# Altium project FMC-320U-B1.PrjPcb
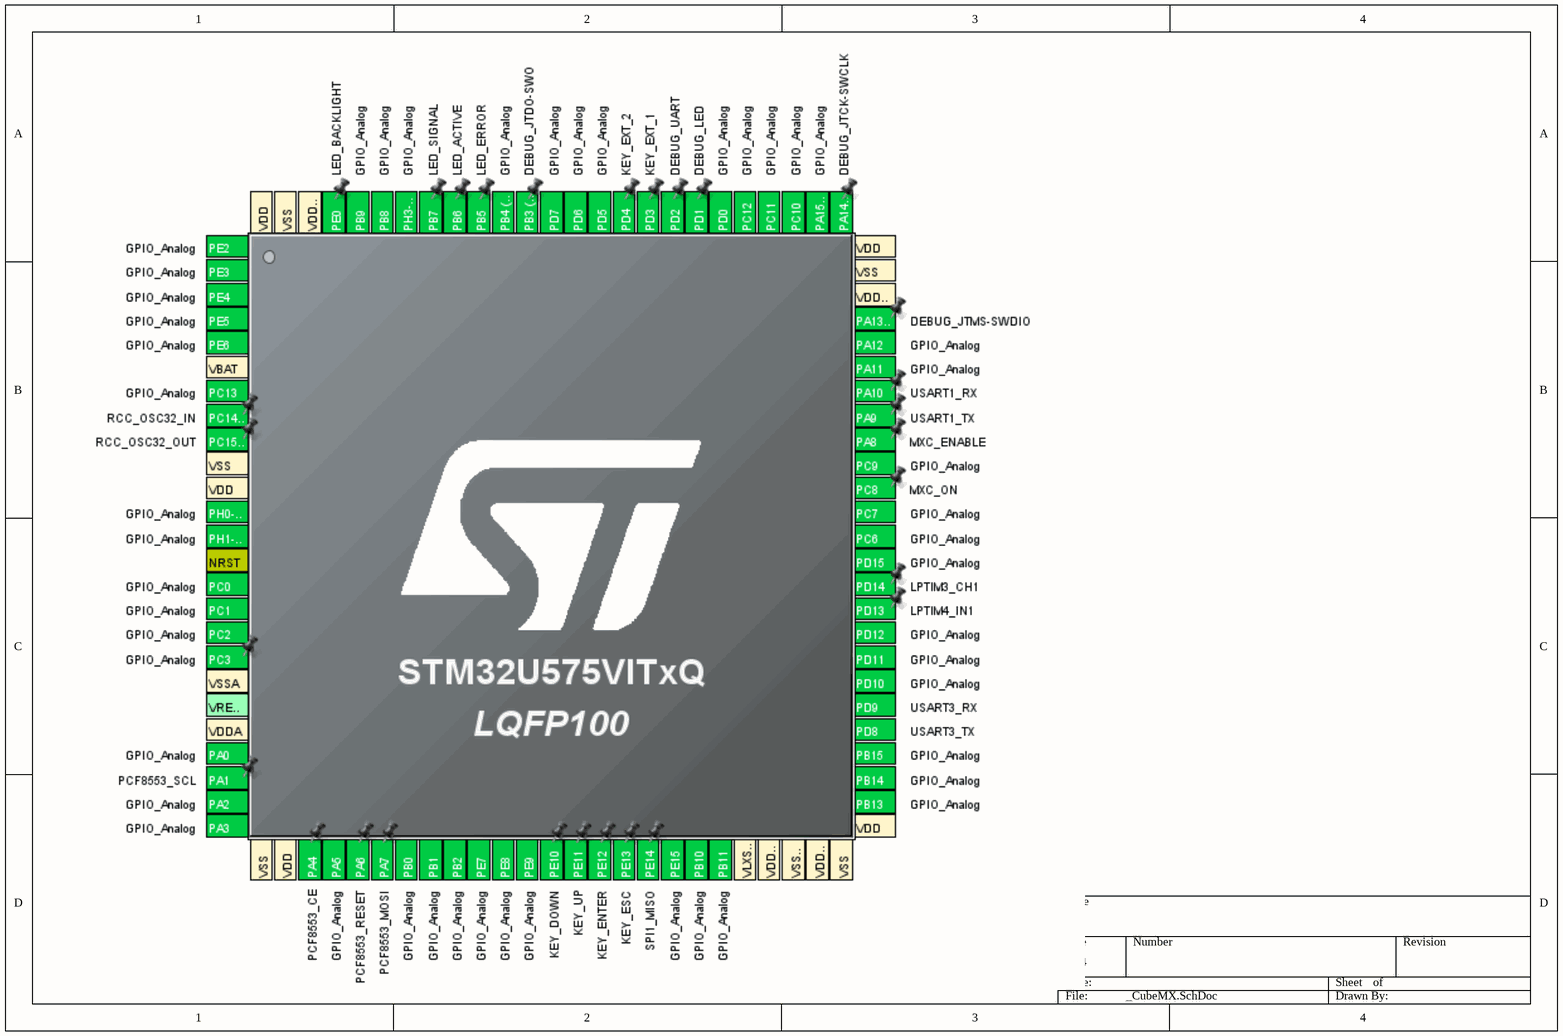
[diagram p0: _CubeMX.SchDoc]
7 sheets, 83 parts. Net scope: flat (ports and power ports of the same name join across sheets).
Board file: FMC-320U-B1.PcbDoc
Sheets:
  _CubeMX.SchDoc
  Display_Indicators.SchDoc
  Interboard.SchDoc
  Keypad_Temp_BatLevel.SchDoc
  MCU_Debug.SchDoc
  MCU_GPIO.SchDoc
  MCU_Power_Clock.SchDoc

## Sheet _CubeMX.SchDoc
size A4; SheetNumber: 7; SheetTotal: 7

## Sheet Display_Indicators.SchDoc
size A4; Organization: Altium Limited; Address1: L3, 12a Rodborough Rd; Address2: Frenchs Forest; Address3: NSW; Address4: Australia 2086; SheetNumber: 2; SheetTotal: 7
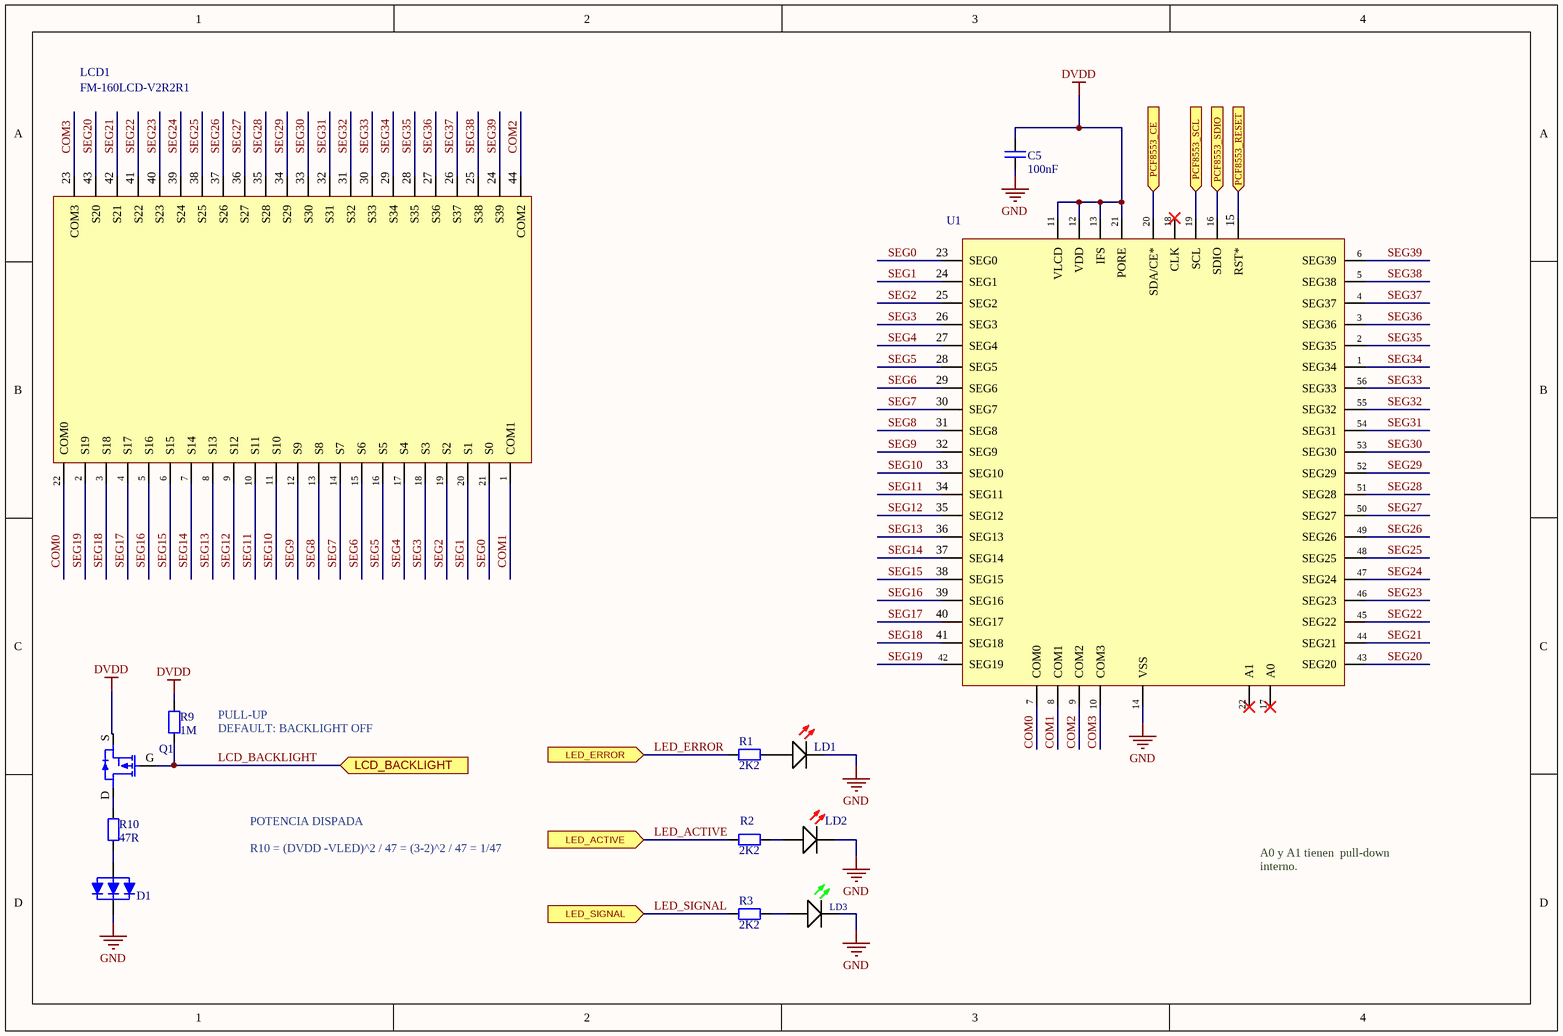
[diagram p1: Display_Indicators.SchDoc]

### Parts
C5  100nF  [CAP_SM0603_YAGEOCC2_N]
D1  BACKLIGHT  [BACKLIGHT_2]  (value not drawn)  (no BOM)
LCD1  FM-160LCD-V2R2R1  [FMC-160LCD V2]
LD1  RED  [LED 0805]  (value not drawn)
LD2  RED  [LED 0805]  (value not drawn)
LD3  GREEN  [LED 0805]  (value not drawn)
Q1  DMG3401LSN-7  [DMG3401LSN-7]  (value not drawn)
R1  2K2  [RES_SM0603_YAGEORC_N]
R2  2K2  [RES_SM0603_YAGEORC_N]
R3  2K2  [RES_SM0603_YAGEORC_N]
R9  1M  [RES_SM0603_YAGEORC_N]
R10  47R  [RES_SM0603_YAGEORC_N]
U1  (no value)  [LCD DRIVER - TSSOP56]

### Ports
LCD_BACKLIGHT (in), LED_ACTIVE (in), LED_ERROR (in), LED_SIGNAL (in), PCF8553_CE (in), PCF8553_RESET (in), PCF8553_SCL (in), PCF8553_SDIO (in)

### Nets
DVDD: C5.1 Q1.S R9.2 U1.11(VLCD) U1.12(VDD) U1.13(IFS) U1.21(PORE)
GND: C5.2 D1.2 LD1.K LD2.K LD3.K U1.14(VSS)
COM0: LCD1.22(COM0) U1.7(COM0)
COM1: LCD1.1(COM1) U1.8(COM1)
COM2: LCD1.44(COM2) U1.9(COM2)
COM3: LCD1.23(COM3) U1.10(COM3)
LCD_BACKLIGHT: Q1.G R9.1 ; port LCD_BACKLIGHT
LED_ACTIVE: R2.1 ; port LED_ACTIVE
LED_ERROR: R1.1 ; port LED_ERROR
LED_SIGNAL: R3.1 ; port LED_SIGNAL
SEG0: LCD1.21(S0) U1.23(SEG0)
SEG1: LCD1.20(S1) U1.24(SEG1)
SEG2: LCD1.19(S2) U1.25(SEG2)
SEG3: LCD1.18(S3) U1.26(SEG3)
SEG4: LCD1.17(S4) U1.27(SEG4)
SEG5: LCD1.16(S5) U1.28(SEG5)
SEG6: LCD1.15(S6) U1.29(SEG6)
SEG7: LCD1.14(S7) U1.30(SEG7)
SEG8: LCD1.13(S8) U1.31(SEG8)
SEG9: LCD1.12(S9) U1.32(SEG9)
SEG10: LCD1.11(S10) U1.33(SEG10)
SEG11: LCD1.10(S11) U1.34(SEG11)
SEG12: LCD1.9(S12) U1.35(SEG12)
SEG13: LCD1.8(S13) U1.36(SEG13)
SEG14: LCD1.7(S14) U1.37(SEG14)
SEG15: LCD1.6(S15) U1.38(SEG15)
SEG16: LCD1.5(S16) U1.39(SEG16)
SEG17: LCD1.4(S17) U1.40(SEG17)
SEG18: LCD1.3(S18) U1.41(SEG18)
SEG19: LCD1.2(S19) U1.42(SEG19)
SEG20: LCD1.43(S20) U1.43(SEG20)
SEG21: LCD1.42(S21) U1.44(SEG21)
SEG22: LCD1.41(S22) U1.45(SEG22)
SEG23: LCD1.40(S23) U1.46(SEG23)
SEG24: LCD1.39(S24) U1.47(SEG24)
SEG25: LCD1.38(S25) U1.48(SEG25)
SEG26: LCD1.37(S26) U1.49(SEG26)
SEG27: LCD1.36(S27) U1.50(SEG27)
SEG28: LCD1.35(S28) U1.51(SEG28)
SEG29: LCD1.34(S29) U1.52(SEG29)
SEG30: LCD1.33(S30) U1.53(SEG30)
SEG31: LCD1.32(S31) U1.54(SEG31)
SEG32: LCD1.31(S32) U1.55(SEG32)
SEG33: LCD1.30(S33) U1.56(SEG33)
SEG34: LCD1.29(S34) U1.1(SEG34)
SEG35: LCD1.28(S35) U1.2(SEG35)
SEG36: LCD1.27(S36) U1.3(SEG36)
SEG37: LCD1.26(S37) U1.4(SEG37)
SEG38: LCD1.25(S38) U1.5(SEG38)
SEG39: LCD1.24(S39) U1.6(SEG39)
NetD1_1: D1.1 R10.1
NetLD1_A: LD1.A R1.2
NetLD2_A: LD2.A R2.2
NetLD3_A: LD3.A R3.2
NetQ1_D: Q1.D R10.2
NetU1_15: U1.15(RST*) ; port PCF8553_RESET
NetU1_16: U1.16(SDIO) ; port PCF8553_SDIO
NetU1_19: U1.19(SCL) ; port PCF8553_SCL
NetU1_20: U1.20(SDA/CE*) ; port PCF8553_CE

Not connected (* = marked no-connect by the designer): U1 17(A0)* 18(CLK)* 22(A1)*

### Notes on the sheet
- (near R9) PULL-UP
  DEFAULT: BACKLIGHT OFF
- POTENCIA DISPADA
  R10 = (DVDD -VLED)^2 / 47 = (3-2)^2 / 47 = 1/47
- A0 y A1 tienen  pull-down interno.
- Title:
- Size: A4
- Date:
- FMC-320U MODEL A
- Sheet:
- Time:
- Of:
- Version:
- Revision:
- Release:
- 1
- 0
- FLOWMEET SRL
- File

### Library data of the parts
C5 = CC0603KRX7R9BB104: CAP 100nF SM0603 X7R 50V YAGEO CC2; Tolerance (%): 10; Voltage Rating (Volts): 50; Category: Capacitor; Manufacturer: Yageo; Manufacturer Part Number: CC0603KRX7R9BB104; Package: 0603; Value: 100nF; Supplier Part Number 1: 1362556; Supplier 1: Farnell; ComponentLink1URL: http://www.yageo.com; ComponentLink1Description: Manufacturer Website; Supplier 2: Digi-Key; Supplier Part Number 2: 311-1344-1-ND; Datasheet: https://datasheet.lcsc.com/lcsc/2211101700_YAGEO-CC0603KRX7R9BB104_C14663.pdf
D1 = FM-160-BACKLIGHT: IF=45mA;VF=3V; Manufacturer: FLOWMEET; Manufacturer Part Number: FM-160-BACKLIGHT; Category: Backlight; Datasheet: -; Temperature Max: -; Temperature Min: -
LCD1 = FM-160LCD-V2R2R1: Manufacturer: FLOWMEET; Manufacturer Part Number: FM-160LCD-V2R2R1; Category: LCD; Datasheet: -; Temperature Max: 70; Temperature Min: -20
LD1 LD2 = 17-21SURC/S530-A2/TR8: Manufacturer: Everlight Elec; Manufacturer Part Number: 17-21SURC/S530-A2/TR8; Category: LED; Datasheet: https://mm.digikey.com/Volume0/opasdata/d220001/medias/docus/2236/17-21SURC-S530-A2-TR8-V5~.pdf; Temperature Max: 85; Temperature Min: -40
LD3 = 17-21SYGC/S530-E2/TR8: Manufacturer: Everlight Elec; Manufacturer Part Number: 21SYGC/S530-E2/TR8; Category: LED; Datasheet: https://mm.digikey.com/Volume0/opasdata/d220001/medias/docus/559/17-21SYGC,S530-E2,TR8.pdf; Temperature Max: 85; Temperature Min: -40
Q1 = DMG3401LSN-7: P-CHANNEL ENHANCEMENT MODE MOSFET / RDS(ON) = 85mΩ @ VGS = -2.5V -> ID -2.7A / V(BR)DDS 30V; Manufacturer: Diodes Incorporated; Category: Transistor mosfet; Manufacturer Part Number: DMG3401LSN-7; Datasheet: https://www.diodes.com/assets/Datasheets/DMG3401LSN.pdf; Temperature Max: 150; Temperature Min: -55
R1-R3 = RC0603FR-072K2L: RES 2K2 SM0603 YAGEO RC_L; Power (Watts): 0.1; Resistance (Ohms): 2200; Tolerance (%): 1; Category: Resistor; Manufacturer: Yageo; Manufacturer Part Number: RC0603FR-072K2L; Package: 0603; Value: 2K2; Supplier Part Number 1: 9238522; Supplier 1: Farnell; ComponentLink1URL: http://www.yageo.com; ComponentLink1Description: Manufacturer Website; Supplier 2: Digi-Key; Supplier Part Number 2: 311-2.20KHRCT-ND
R9 = RC0603FR-071ML: RES 1M SM0603 YAGEO RC_L; Power (Watts): 0.1; Resistance (Ohms): 1000000; Tolerance (%): 1; Category: Resistor; Manufacturer: Yageo; Manufacturer Part Number: RC0603FR-071ML; Package: 0603; Value: 1M; Supplier Part Number 1: 9238840; Supplier 1: Farnell; ComponentLink1URL: http://www.yageo.com; ComponentLink1Description: Manufacturer Website; Supplier 2: Digi-Key; Supplier Part Number 2: 311-1.00MHRCT-ND; Datasheet: https://www.yageo.com/upload/media/product/productsearch/datasheet/rchip/PYu-RC_Group_51_RoHS_L_12.pdf
R10 = RC0603FR-0747RL: RES 47R SM0603 YAGEO RC_L; Power (Watts): 0.1; Resistance (Ohms): 47; Tolerance (%): 1; Category: Resistor; Manufacturer: Yageo; Manufacturer Part Number: RC0603FR-0747RL; Package: 0603; Value: 47R; Supplier Part Number 1: 9238328; Supplier 1: Farnell; ComponentLink1URL: http://www.yageo.com; ComponentLink1Description: Manufacturer Website; Supplier 2: Digi-Key; Supplier Part Number 2: 311-47.0HRCT-ND
U1 = PCF8553DTT/AY: 40 × 4 LCD SEGMENT DRIVER; Manufacturer: NXP; Manufacturer Part Number: PCF8553DTT/AY; Category: Driver; Datasheet: https://datasheet.lcsc.com/lcsc/2107141507_NXP-Semicon-PCF8553DTT-AJ_C2653705.pdf; Temperature Max: 85; Temperature Min: -40

## Sheet Interboard.SchDoc
size A4; SheetNumber: 6; SheetTotal: 7
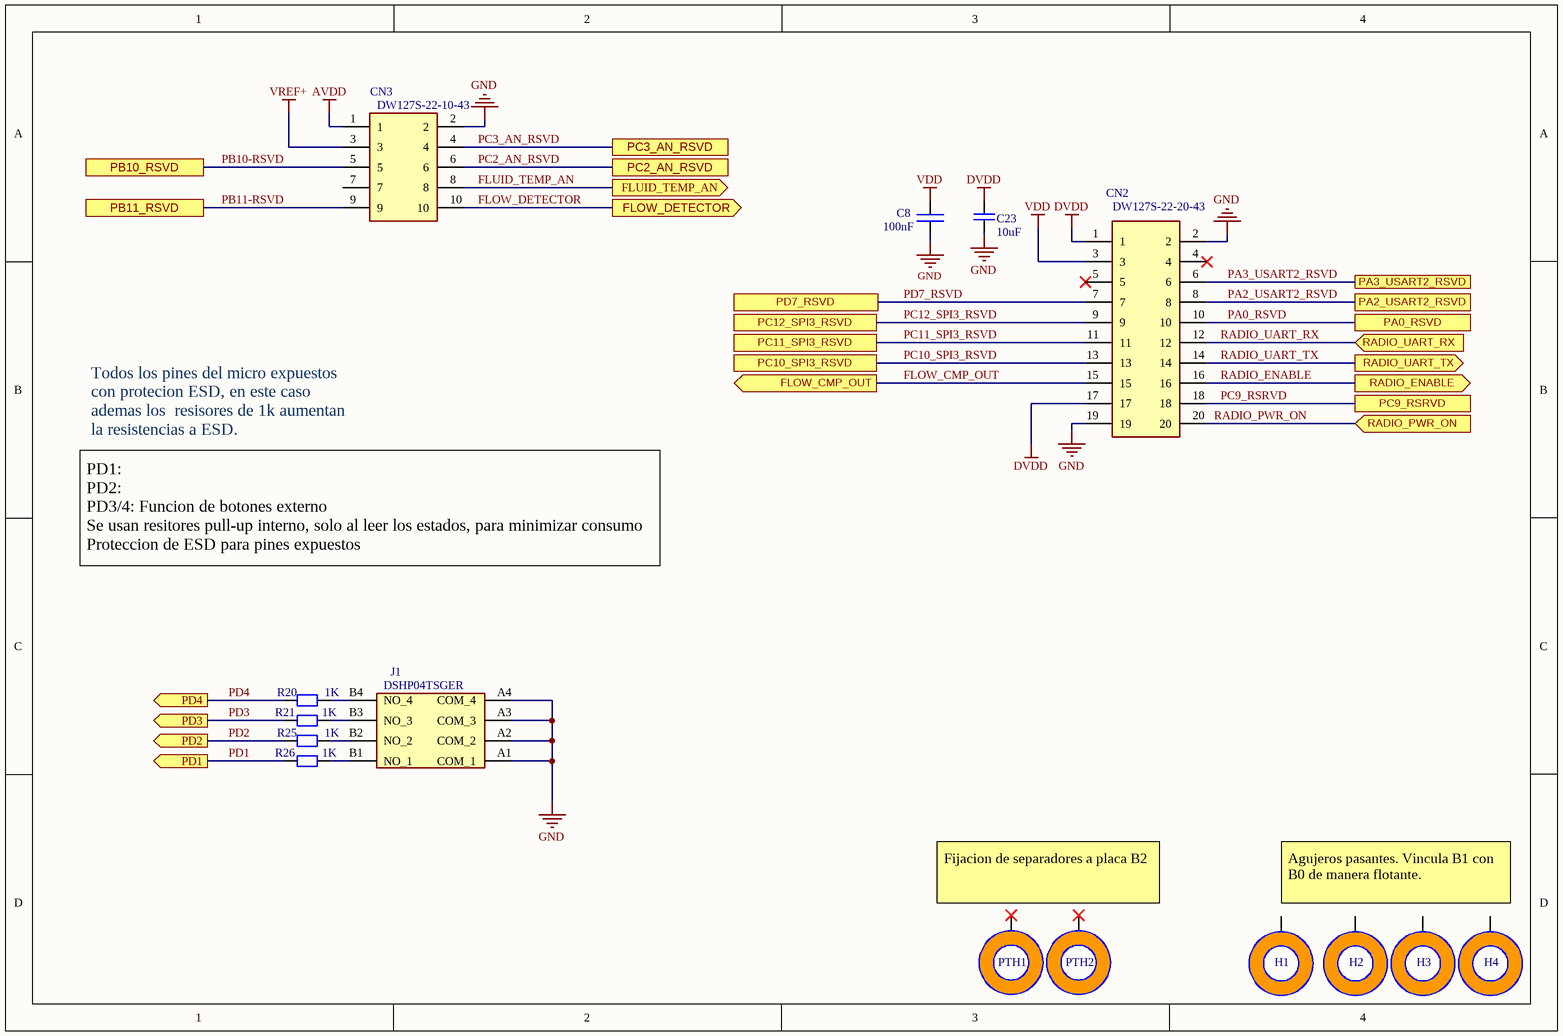
[diagram p2: Interboard.SchDoc]

### Parts
C8  100nF  [CAP_SM0603_YAGEOCC2_N]
C23  10uF  [CAP_SM0603_YAGEOCC2_N]
CN2  DW127S-22-20-43  [DW127S-22-20-43]
CN3  DW127S-22-10-43  [DW127S-22-10-43]
H1  C193465-HOLE  [C193465-HOLE]  (value not drawn)  (no BOM)
H2  C193465-HOLE  [C193465-HOLE]  (value not drawn)  (no BOM)
H3  C193465-HOLE  [C193465-HOLE]  (value not drawn)  (no BOM)
H4  C193465-HOLE  [C193465-HOLE]  (value not drawn)  (no BOM)
J1  DSHP04TSGER  [DSHP04TSGER]
PTH1  PTH-2MM-M  [PTH_M2_M]  (value not drawn)  (no BOM)
PTH2  PTH-2MM-M  [PTH_M2_M]  (value not drawn)  (no BOM)
R20  1K  [RES_SM0603_YAGEORC_N]
R21  1K  [RES_SM0603_YAGEORC_N]
R25  1K  [RES_SM0603_YAGEORC_N]
R26  1K  [RES_SM0603_YAGEORC_N]

### Ports
FLOW_CMP_OUT (out), FLOW_DETECTOR (out), FLUID_TEMP_AN (out), PA0_RSVD, PA2_USART2_RSVD, PA3_USART2_RSVD, PB10_RSVD, PB11_RSVD, PC2_AN_RSVD, PC3_AN_RSVD, PC9_RSRVD, PC10_SPI3_RSVD, PC11_SPI3_RSVD, PC12_SPI3_RSVD, PD1 (out), PD2 (out), PD3 (out), PD4 (out), PD7_RSVD, RADIO_ENABLE (out), RADIO_PWR_ON (in), RADIO_UART_RX (in), RADIO_UART_TX (out)

### Nets
AVDD: CN3.1
DVDD: C23.1 CN2.1 CN2.17
GND: C8.2 C23.2 CN2.2 CN2.19 CN3.2 J1.A1(COM_1) J1.A2(COM_2) J1.A3(COM_3) J1.A4(COM_4)
VDD: C8.1 CN2.3
VREF+: CN3.3
FLOW_CMP_OUT: CN2.15 ; port FLOW_CMP_OUT
FLOW_DETECTOR: CN3.10 ; port FLOW_DETECTOR
FLUID_TEMP_AN: CN3.8 ; port FLUID_TEMP_AN
PA0_RSVD: CN2.10 ; port PA0_RSVD
PA2_USART2_RSVD: CN2.8 ; port PA2_USART2_RSVD
PA3_USART2_RSVD: CN2.6 ; port PA3_USART2_RSVD
PB10-RSVD: CN3.5 ; port PB10_RSVD
PB11-RSVD: CN3.9 ; port PB11_RSVD
PC2_AN_RSVD: CN3.6 ; port PC2_AN_RSVD
PC3_AN_RSVD: CN3.4 ; port PC3_AN_RSVD
PC9_RSRVD: CN2.18 ; port PC9_RSRVD
PC10_SPI3_RSVD: CN2.13 ; port PC10_SPI3_RSVD
PC11_SPI3_RSVD: CN2.11 ; port PC11_SPI3_RSVD
PC12_SPI3_RSVD: CN2.9 ; port PC12_SPI3_RSVD
PD1: R26.2 ; port PD1
PD2: R25.2 ; port PD2
PD3: R21.2 ; port PD3
PD4: R20.2 ; port PD4
PD7_RSVD: CN2.7 ; port PD7_RSVD
RADIO_ENABLE: CN2.16 ; port RADIO_ENABLE
RADIO_PWR_ON: CN2.20 ; port RADIO_PWR_ON
RADIO_UART_RX: CN2.12 ; port RADIO_UART_RX
RADIO_UART_TX: CN2.14 ; port RADIO_UART_TX
NetJ1_B1: J1.B1(NO_1) R26.1
NetJ1_B2: J1.B2(NO_2) R25.1
NetJ1_B3: J1.B3(NO_3) R21.1
NetJ1_B4: J1.B4(NO_4) R20.1

Not connected (* = marked no-connect by the designer): CN2 4* 5*; CN3 7; H1 1; H2 1; H3 1; H4 1; PTH1 1*; PTH2 1*

### Notes on the sheet
- Todos los pines del micro expuestos con protecion ESD, en este caso ademas los  resisores de 1k aumentan la resistencias a ESD.
- PD1:
  PD2:
  PD3/4: Funcion de botones externo
  Se usan resitores pull-up interno, solo al leer los estados, para minimizar consumo
  Proteccion de ESD para pines expuestos
- Fijacion de separadores a placa B2
- Agujeros pasantes. Vincula B1 con B0 de manera flotante.
- Title:
- Size: A4
- Date:
- Sheet:
- Time:
- Of:
- Version:
- Revision:
- Release:
- FLOWMEET SRL
- File

### Library data of the parts
C8 = CC0603KRX7R9BB104: as C5 on sheet Display_Indicators; Category: Capacitor; Manufacturer: Yageo; Manufacturer Part Number: CC0603KRX7R9BB104; Package: 0603; Value: 100nF; ComponentLink1Description: Manufacturer Website; ComponentLink1URL: http://www.yageo.com; Supplier Part Number 1: 1362556; Supplier 1: Farnell; Supplier 2: Digi-Key; Supplier Part Number 2: 311-1344-1-ND; Datasheet: https://datasheet.lcsc.com/lcsc/2211101700_YAGEO-CC0603KRX7R9BB104_C14663.pdf
C23 = CC0603KRX5R6BB106: CAP 10uF SM0603 X5R 10V YAGEO; Tolerance: 10; Category: Capacitor; Manufacturer: Yageo; Manufacturer Part Number: CC0603KRX5R6BB106; Package: 0603; Value: 10uF; ComponentLink1Description: Manufacturer Website; ComponentLink1URL: http://www.yageo.com
CN2 = DW127S-22-20-43: Header Female SMD 1.27mm 2x10; Manufacturer: Dealon; Vendor: LCSC; Manufacturer_Part_Number: DW127S-22-20-43
CN3 = DW127S-22-10-43: Header Female SMD 1.27mm 2x5; Manufacturer: Dealon; Vendor: LCSC; Manufacturer Part Number: DW127S-22-10-43; Vendor Part Number: *
H1-H4 = C193465-HOLE: Agujero pasante; Category: Mounting Hole; Temperature Max: -; Temperature Min: -
J1 = DSHP04TSGER: DIP Switches / SIP Switches 4pos 0.025A 24VDC 1/2 Pitch; Manufacturer: Kangshen; Vendor Part Number: C3293144; Vendor: LCSC; Manufacturer Part Number: DSHP04TSGER
PTH1 PTH2 = PTH-2MM-M: Montaje rosca 2mm, holgura miniama; Category: Mounting Hole; Temperature Max: -; Temperature Min: -
R20 R21 R25 R26 = RC0603FR-071KL: RES 1K SM0603 YAGEO RC_L; Power (Watts): 0.1; Resistance (Ohms): 1000; Tolerance (%): 1; Category: Resistor; Manufacturer: Yageo; Manufacturer Part Number: RC0603FR-071KL; Package: 0603; Value: 1K; Supplier Part Number 1: 9238484; Supplier 1: Farnell; ComponentLink1URL: http://www.yageo.com; ComponentLink1Description: Manufacturer Website; Supplier 2: Digi-Key; Supplier Part Number 2: 311-1.00KHRCT-ND

## Sheet Keypad_Temp_BatLevel.SchDoc
size A4; SheetNumber: 4; SheetTotal: 7
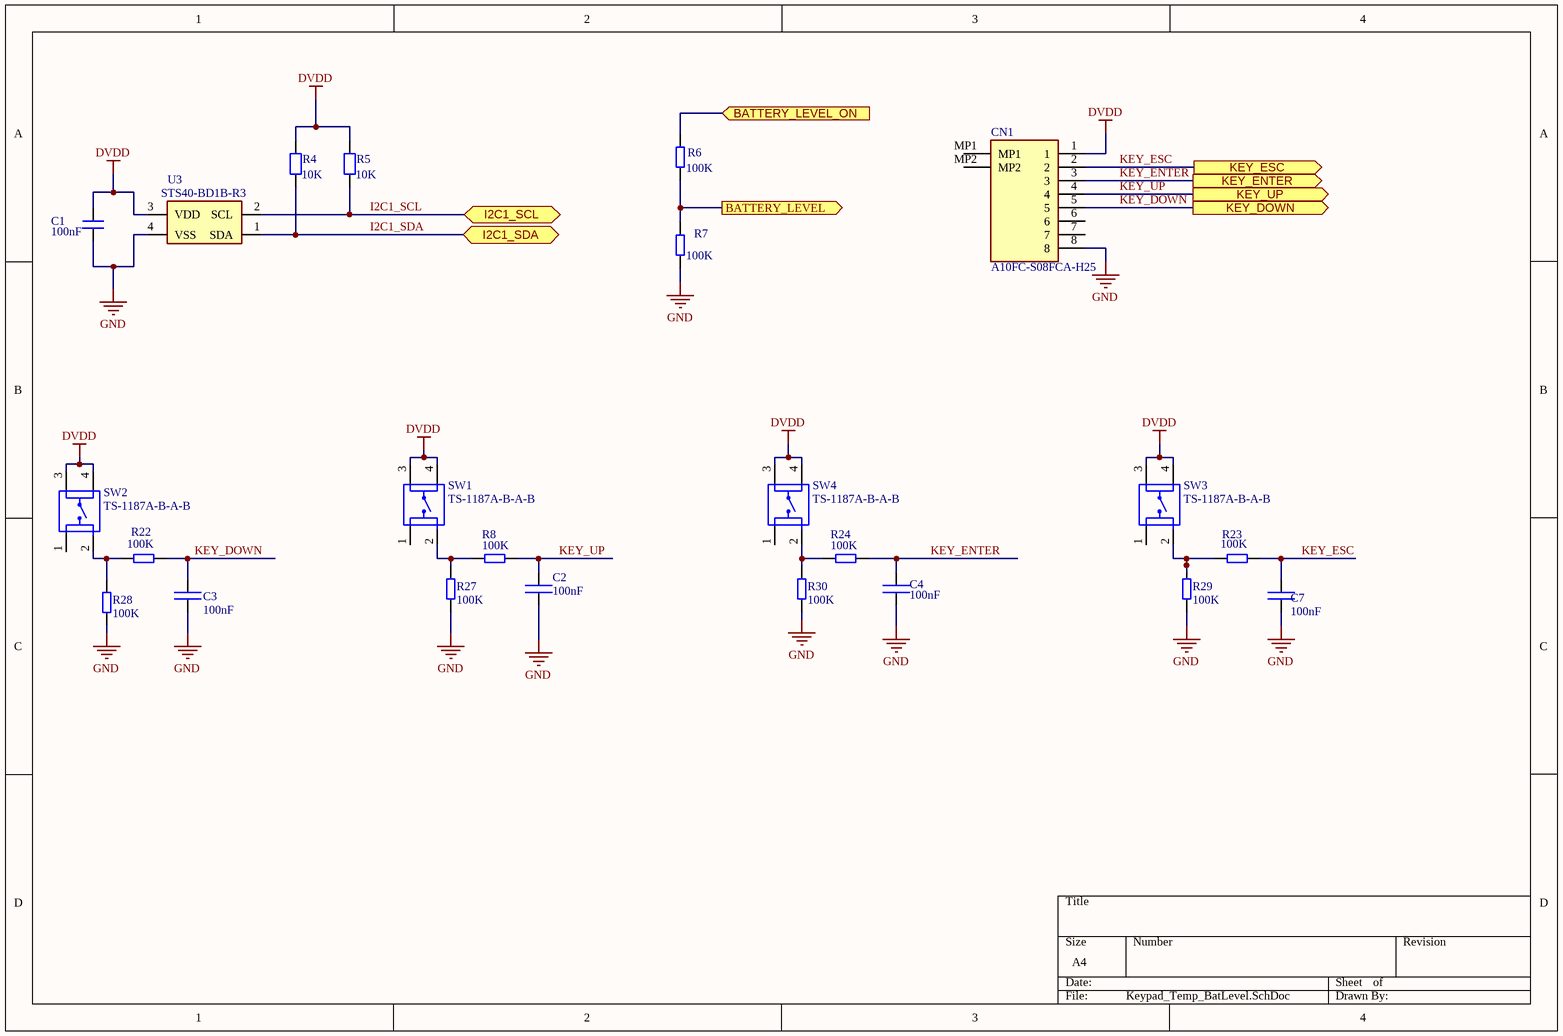
[diagram p3: Keypad_Temp_BatLevel.SchDoc]

### Parts
C1  100nF  [CAP_SM0603_YAGEOCC2_N]
C2  100nF  [CAP_SM0603_YAGEOCC2_N]
C3  100nF  [CAP_SM0603_YAGEOCC2_N]
C4  100nF  [CAP_SM0603_YAGEOCC2_N]
C7  100nF  [CAP_SM0603_YAGEOCC2_N]
CN1  A10FC-S08FCA-H25  [849528]
R4  10K  [RES_SM0603_YAGEORC_N]
R5  10K  [RES_SM0603_YAGEORC_N]
R6  100K  [RES_SM0603_YAGEORC_N]
R7  100K  [RES_SM0603_YAGEORC_N]
R8  100K  [RES_SM0603_YAGEORC_N]
R22  100K  [RES_SM0603_YAGEORC_N]
R23  100K  [RES_SM0603_YAGEORC_N]
R24  100K  [RES_SM0603_YAGEORC_N]
R27  100K  [RES_SM0603_YAGEORC_N]
R28  100K  [RES_SM0603_YAGEORC_N]
R29  100K  [RES_SM0603_YAGEORC_N]
R30  100K  [RES_SM0603_YAGEORC_N]
SW1  TS-1187A-B-A-B  [TS-1187A-B-A-B]
SW2  TS-1187A-B-A-B  [TS-1187A-B-A-B]
SW3  TS-1187A-B-A-B  [TS-1187A-B-A-B]
SW4  TS-1187A-B-A-B  [TS-1187A-B-A-B]
U3  STS40-BD1B-R3  [STS40BD1BR3]

### Ports
BATTERY_LEVEL (out), BATTERY_LEVEL_ON (in), I2C1_SCL (bidir), I2C1_SDA (bidir), KEY_DOWN (out), KEY_ENTER (out), KEY_ESC (out), KEY_UP (out)

### Nets
DVDD: C1.2 CN1.1 R4.2 R5.2 SW1.3(g) SW1.4 SW2.3(g) SW2.4 SW3.3(g) SW3.4 SW4.3(g) SW4.4 U3.3(VDD)
GND: C1.1 C2.2 C3.1 C4.2 C7.2 CN1.8 R7.1 R27.1 R28.1 R29.1 R30.1 U3.4(VSS)
I2C1_SCL: R5.1 U3.2(SCL) ; port I2C1_SCL
I2C1_SDA: R4.1 U3.1(SDA) ; port I2C1_SDA
KEY_DOWN: C3.2 CN1.5 R22.2 ; port KEY_DOWN
KEY_ENTER: C4.1 CN1.3 R24.2 ; port KEY_ENTER
KEY_ESC: C7.1 CN1.2 R23.2 ; port KEY_ESC
KEY_UP: C2.1 CN1.4 R8.2 ; port KEY_UP
NetR6_1: R6.1 R7.2 ; port BATTERY_LEVEL
NetR6_2: R6.2 ; port BATTERY_LEVEL_ON
NetR8_1: R8.1 R27.2 SW1.2
NetR22_1: R22.1 R28.2 SW2.2
NetR23_1: R23.1 R29.2 SW3.2
NetR24_1: R24.1 R30.2 SW4.2

Not connected (* = marked no-connect by the designer): CN1 6 7 MP1 MP2; SW1 1; SW2 1; SW3 1; SW4 1

### Library data of the parts
C1-C4 C7 = CC0603KRX7R9BB104: as C5 on sheet Display_Indicators; Category: Capacitor; Manufacturer: Yageo; Manufacturer Part Number: CC0603KRX7R9BB104; Package: 0603; Value: 100nF; Supplier Part Number 1: 1362556; Supplier 1: Farnell; ComponentLink1URL: http://www.yageo.com; ComponentLink1Description: Manufacturer Website; Supplier 2: Digi-Key; Supplier Part Number 2: 311-1344-1-ND; Datasheet: https://datasheet.lcsc.com/lcsc/2211101700_YAGEO-CC0603KRX7R9BB104_C14663.pdf
CN1 = A10FC-S08FCA-H25: FFC/FPC Connector 8 Position 1mm Pitch Bottom Contact Surface Mount, Right Angle -40℃~+85℃; Manufacturer: JXTCONN; Vendor Part Number: C42447839; Vendor: LCSC; Manufacturer Part Number: A10FC-S08FCA-H25; Price: 0.089
R4 R5 = RC0603FR-0710KL: RES 10K SM0603 YAGEO RC_L; Power (Watts): 0.1; Resistance (Ohms): 10000; Tolerance (%): 1; Category: Resistor; Manufacturer: Yageo; Manufacturer Part Number: RC0603FR-0710KL; Package: 0603; Value: 10K; Supplier Part Number 1: 9238603; Supplier 1: Farnell; ComponentLink1Description: Manufacturer Website; ComponentLink1URL: http://www.yageo.com; Supplier 2: Digi-Key; Supplier Part Number 2: 311-10.0KHRCT-ND
R6-R8 R22-R24 R27-R30 = RC0603FR-13100KL: RES 100K SM0603 YAGEO RC_L; Power (Watts): 0.1; Resistance (Ohms): 100000; Tolerance (%): 1; Category: Resistor; Manufacturer: Yageo; Manufacturer Part Number: RC0603FR-13100KL; Package: 0603; Value: 100K; Supplier Part Number 1: 2309107; Supplier 1: Farnell; ComponentLink1Description: Manufacturer Website; ComponentLink1URL: http://www.yageo.com; Supplier 2: Digi-Key
SW1-SW4 = TS-1187A-B-A-B: Switch tactile SMD; Manufacturer: XKB Connectivity; Vendor Part Number: C318884; Vendor: LCSC; Manufacturer Part Number: TS-1187A-B-A-B
U3 = STS40-BD1B-R3: Board Mount Temperature Sensors Base Accuracy Version, I2C Address 0x45; Manufacturer: Sensirion; Manufacturer Part Number: STS40-BD1B-R3

## Sheet MCU_Debug.SchDoc
size A4; Organization: Altium Limited; Address1: L3, 12a Rodborough Rd; Address2: Frenchs Forest; Address3: NSW; Address4: Australia 2086; SheetNumber: 5; SheetTotal: 7
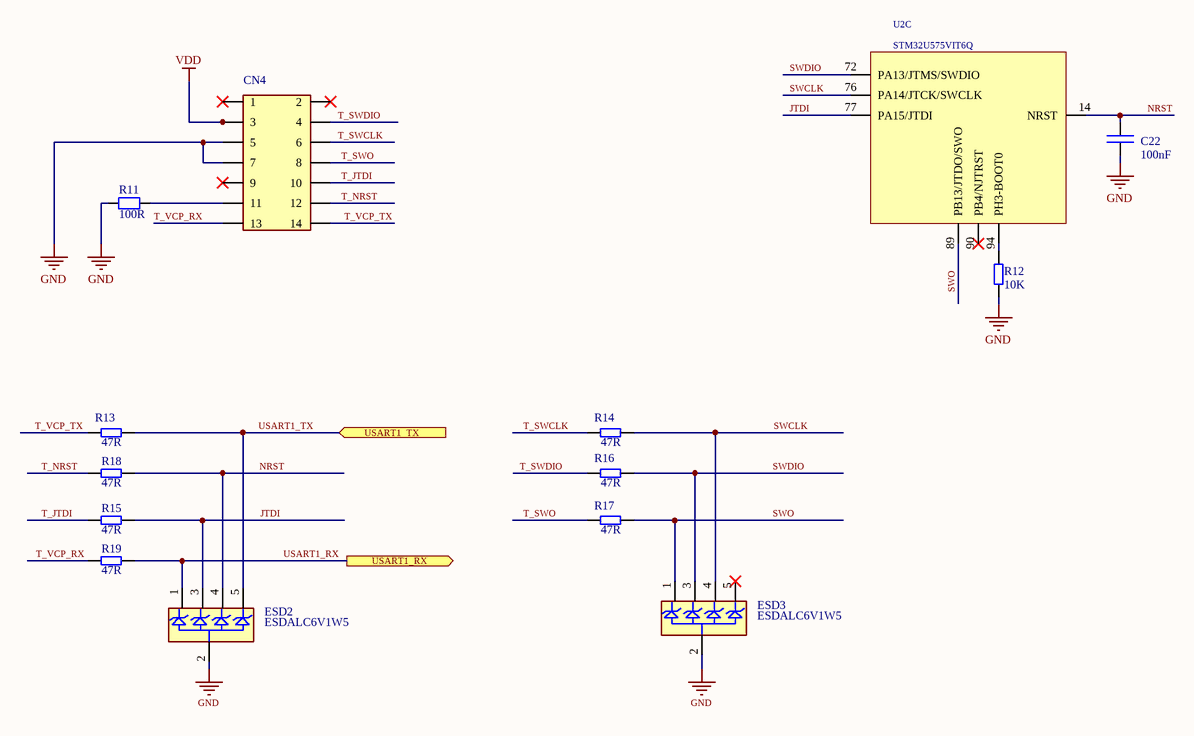
[diagram p4: MCU_Debug.SchDoc]

### Parts
C22  100nF  [CAP_SM0603_YAGEOCC2_N]
CN4  20021511-00014T4LF  [2002151100014T4LF]  (value not drawn)
ESD2  ESDALC6V1W5  [ESDALC6V1W5]
ESD3  ESDALC6V1W5  [ESDALC6V1W5]
R11  100R  [RES_SM0603_YAGEORC_N]
R12  10K  [RES_SM0603_YAGEORC_N]
R13  47R  [RES_SM0603_YAGEORC_N]
R14  47R  [RES_SM0603_YAGEORC_N]
R15  47R  [RES_SM0603_YAGEORC_N]
R16  47R  [RES_SM0603_YAGEORC_N]
R17  47R  [RES_SM0603_YAGEORC_N]
R18  47R  [RES_SM0603_YAGEORC_N]
R19  47R  [RES_SM0603_YAGEORC_N]
U2  STM32U575VIT6Q  [STM32U575VI]  (part C of 3)

### Ports
USART1_RX (out), USART1_TX (in)

### Nets
GND: C22.2 CN4.5 CN4.7 ESD2.2(GND) ESD3.2(GND) R11.1 R12.1
VDD: CN4.3
JTDI: ESD2.3(I/02) R15.2 U2.77(PA15/JTDI)
NRST: C22.1 ESD2.4(I/03) R18.2 U2.14(NRST)
SWCLK: ESD3.4(I/03) R14.2 U2.76(PA14/JTCK/SWCLK)
SWDIO: ESD3.3(I/02) R16.2 U2.72(PA13/JTMS/SWDIO)
SWO: ESD3.1(I/01) R17.2 U2.89(PB13/JTDO/SWO)
T_JTDI: CN4.10 R15.1
T_NRST: CN4.12 R18.1
T_SWCLK: CN4.6 R14.1
T_SWDIO: CN4.4 R16.1
T_SWO: CN4.8 R17.1
T_VCP_RX: CN4.13 R19.1
T_VCP_TX: CN4.14 R13.1
USART1_RX: ESD2.1(I/01) R19.2 ; port USART1_RX
USART1_TX: ESD2.5(I/04) R13.2 ; port USART1_TX
NetCN4_11: CN4.11 R11.2
NetR12_2: R12.2 U2.94(PH3-BOOT0)

Not connected (* = marked no-connect by the designer): CN4 1* 2* 9*; ESD3 5(I/04)*; U2 90(PB4/NJTRST)*

### Notes on the sheet
- Title:
- Size: A4
- Date:
- FMC-320U MODEL A
- Sheet:
- Time:
- Of:
- Version:
- Revision:
- Release:
- 1
- 0
- FLOWMEET SRL
- File

### Library data of the parts
C22 = CC0603KRX7R9BB104: as C5 on sheet Display_Indicators; Category: Capacitor; Manufacturer: Yageo; Manufacturer Part Number: CC0603KRX7R9BB104; Package: 0603; Value: 100nF; Supplier Part Number 1: 1362556; Supplier 1: Farnell; ComponentLink1URL: http://www.yageo.com; ComponentLink1Description: Manufacturer Website; Supplier 2: Digi-Key; Supplier Part Number 2: 311-1344-1-ND; Datasheet: https://datasheet.lcsc.com/lcsc/2211101700_YAGEO-CC0603KRX7R9BB104_C14663.pdf
CN4 = 20021511-00014T4LF: 1.27mm (0.05in.) pitch, Shrouded pin header, 14 contacts; Manufacturer: Amphenol ICC; Manufacturer Part Number: 20021511-00014T4LF
ESD2 ESD3 = ESDALC6V1W5: TVS Diode Array Uni-Directional 6.1V / QTY 5 per pack, SOT-323 / Ranking 5: / Marca reconocida. / Usado en placas nucleo, sometidas a manipuleo nunca note un pin quemado por ESD.; Manufacturer: ST; Manufacturer Part Number: ESDALC6V1W5; Category: Diodo; Datasheet: https://www.st.com/content/ccc/resource/technical/document/datasheet/32/30/02/e6/ac/0f/46/c2/CD00002946.pdf/files/CD00002946.pdf/jcr:content/translations/en.CD00002946.pdf; Temperature Max: 150; Temperature Min: -40
R11 = RC0603FR-07100RL: RES 100R SM0603 YAGEO RC_L; Power (Watts): 0.1; Resistance (Ohms): 100; Tolerance (%): 1; Category: Resistor; Manufacturer: Yageo; Manufacturer Part Number: RC0603FR-07100RL; Package: 0603; Value: 100R; Supplier Part Number 1: 9238360; Supplier 1: Farnell; ComponentLink1URL: http://www.yageo.com; ComponentLink1Description: Manufacturer Website; Supplier 2: Digi-Key; Supplier Part Number 2: 311-100HRCT-ND
R12 = RC0603FR-0710KL: as R4 on sheet Keypad_Temp_BatLevel; Category: Resistor; Manufacturer: Yageo; Manufacturer Part Number: RC0603FR-0710KL; Package: 0603; Value: 10K; Supplier Part Number 1: 9238603; Supplier 1: Farnell; ComponentLink1URL: http://www.yageo.com; ComponentLink1Description: Manufacturer Website; Supplier 2: Digi-Key; Supplier Part Number 2: 311-10.0KHRCT-ND
R13-R19 = RC0603FR-0747RL: as R10 on sheet Display_Indicators; Category: Resistor; Manufacturer: Yageo; Manufacturer Part Number: RC0603FR-0747RL; Package: 0603; Value: 47R; Supplier Part Number 1: 9238328; Supplier 1: Farnell; ComponentLink1URL: http://www.yageo.com; ComponentLink1Description: Manufacturer Website; Supplier 2: Digi-Key; Supplier Part Number 2: 311-47.0HRCT-ND
U2 = STM32U575VIT6Q: Manufacturer: ST; Manufacturer Part Number: STM32U575VIT6Q; Category: Microcontrolador; Datasheet: https://www.st.com/resource/en/datasheet/stm32u575ag.pdf; Temperature Max: 85; Temperature Min: -40

## Sheet MCU_GPIO.SchDoc
size A4; Organization: Altium Limited; Address1: L3, 12a Rodborough Rd; Address2: Frenchs Forest; Address3: NSW; Address4: Australia 2086; SheetNumber: 6; SheetTotal: 7
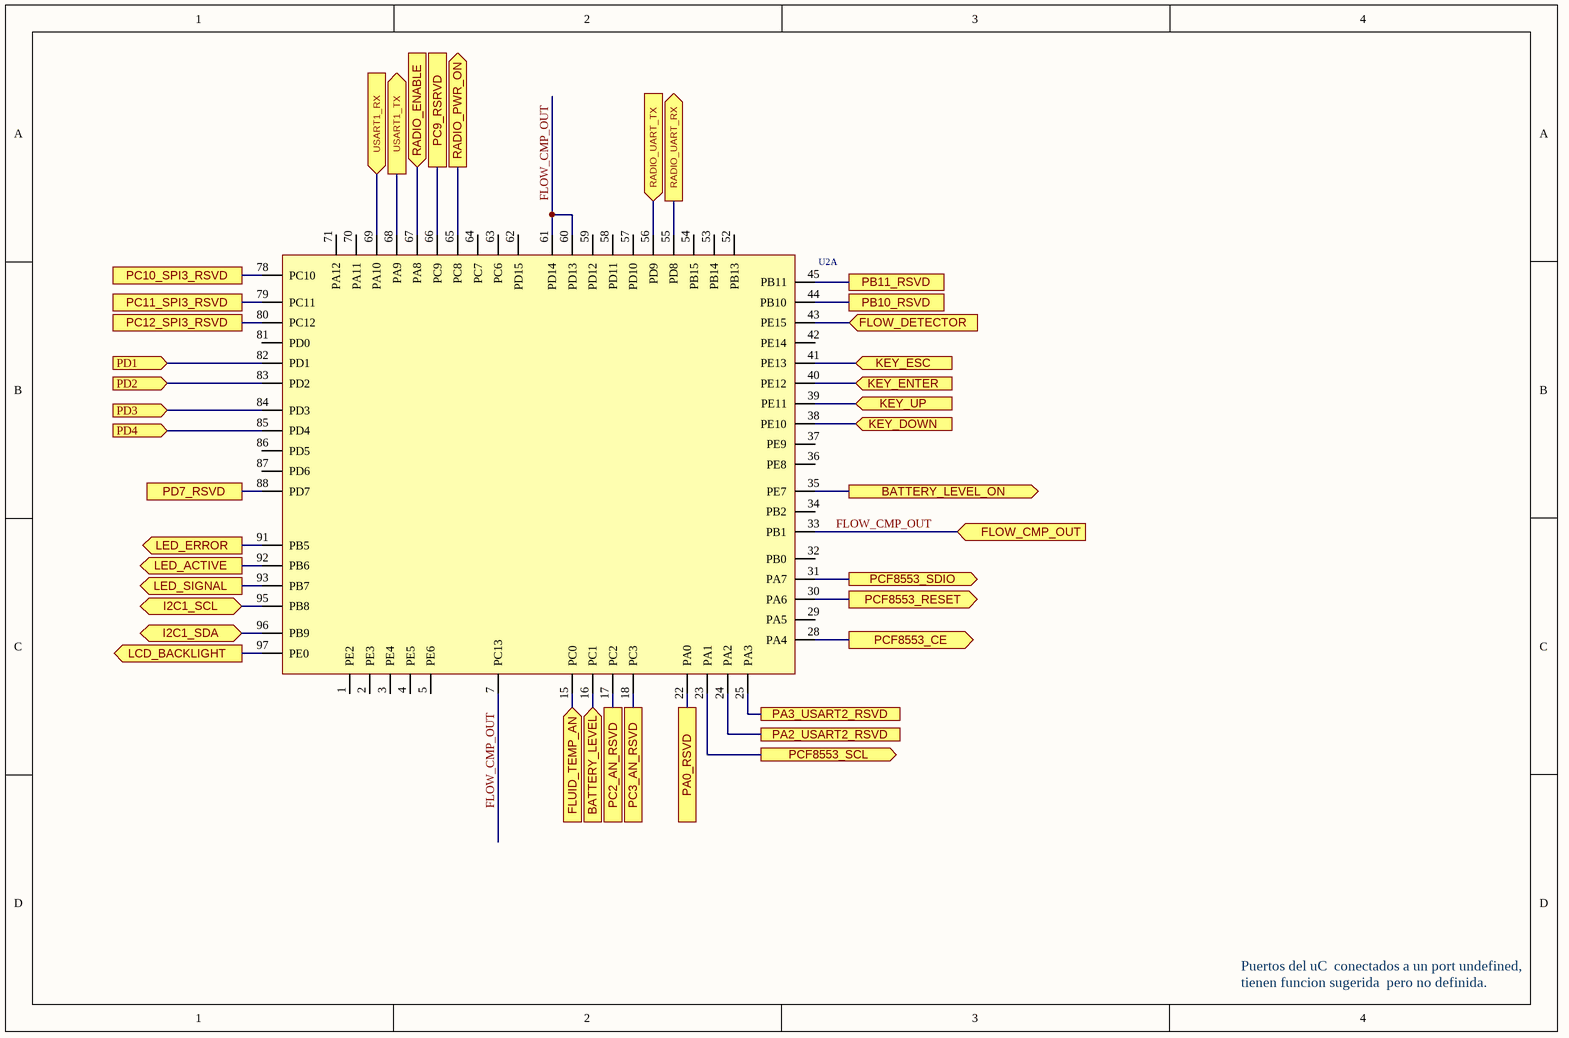
[diagram p5: MCU_GPIO.SchDoc]

### Parts
U2  STM32U575VIT6Q  [STM32U575VI]  (value not drawn)  (part A of 3)

### Ports
BATTERY_LEVEL (in), BATTERY_LEVEL_ON (out), FLOW_CMP_OUT (in), FLOW_DETECTOR (in), FLUID_TEMP_AN (in), I2C1_SCL (bidir), I2C1_SDA (bidir), KEY_DOWN (in), KEY_ENTER (in), KEY_ESC (in), KEY_UP (in), LCD_BACKLIGHT (out), LED_ACTIVE (out), LED_ERROR (out), LED_SIGNAL (out), PA0_RSVD, PA2_USART2_RSVD, PA3_USART2_RSVD, PB10_RSVD, PB11_RSVD, PC2_AN_RSVD, PC3_AN_RSVD, PC9_RSRVD, PC10_SPI3_RSVD, PC11_SPI3_RSVD, PC12_SPI3_RSVD, PCF8553_CE (out), PCF8553_RESET (out), PCF8553_SCL (out), PCF8553_SDIO (out), PD1 (in), PD2 (in), PD3 (in), PD4 (in), PD7_RSVD, RADIO_ENABLE (in), RADIO_PWR_ON (out), RADIO_UART_RX (out), RADIO_UART_TX (in), USART1_RX (in), USART1_TX (out)

### Nets
FLOW_CMP_OUT: U2.7(PC13) U2.33(PB1) U2.60(PD13) U2.61(PD14) ; port FLOW_CMP_OUT
FLOW_DETECTOR: U2.43(PE15) ; port FLOW_DETECTOR
FLUID_TEMP_AN: U2.15(PC0) ; port FLUID_TEMP_AN
I2C1_SCL: U2.95(PB8) ; port I2C1_SCL
I2C1_SDA: U2.96(PB9) ; port I2C1_SDA
KEY_DOWN: U2.38(PE10) ; port KEY_DOWN
KEY_ENTER: U2.40(PE12) ; port KEY_ENTER
KEY_ESC: U2.41(PE13) ; port KEY_ESC
KEY_UP: U2.39(PE11) ; port KEY_UP
LCD_BACKLIGHT: U2.97(PE0) ; port LCD_BACKLIGHT
LED_ACTIVE: U2.92(PB6) ; port LED_ACTIVE
LED_ERROR: U2.91(PB5) ; port LED_ERROR
LED_SIGNAL: U2.93(PB7) ; port LED_SIGNAL
PA0_RSVD: U2.22(PA0) ; port PA0_RSVD
PA2_USART2_RSVD: U2.24(PA2) ; port PA2_USART2_RSVD
PA3_USART2_RSVD: U2.25(PA3) ; port PA3_USART2_RSVD
PB10-RSVD: U2.44(PB10) ; port PB10_RSVD
PB11-RSVD: U2.45(PB11) ; port PB11_RSVD
PC2_AN_RSVD: U2.17(PC2) ; port PC2_AN_RSVD
PC3_AN_RSVD: U2.18(PC3) ; port PC3_AN_RSVD
PC9_RSRVD: U2.66(PC9) ; port PC9_RSRVD
PC10_SPI3_RSVD: U2.78(PC10) ; port PC10_SPI3_RSVD
PC11_SPI3_RSVD: U2.79(PC11) ; port PC11_SPI3_RSVD
PC12_SPI3_RSVD: U2.80(PC12) ; port PC12_SPI3_RSVD
PD1: U2.82(PD1) ; port PD1
PD2: U2.83(PD2) ; port PD2
PD3: U2.84(PD3) ; port PD3
PD4: U2.85(PD4) ; port PD4
PD7_RSVD: U2.88(PD7) ; port PD7_RSVD
RADIO_ENABLE: U2.67(PA8) ; port RADIO_ENABLE
RADIO_PWR_ON: U2.65(PC8) ; port RADIO_PWR_ON
RADIO_UART_RX: U2.55(PD8) ; port RADIO_UART_RX
RADIO_UART_TX: U2.56(PD9) ; port RADIO_UART_TX
USART1_RX: U2.69(PA10) ; port USART1_RX
USART1_TX: U2.68(PA9) ; port USART1_TX
NetR6_1: U2.16(PC1) ; port BATTERY_LEVEL
NetR6_2: U2.35(PE7) ; port BATTERY_LEVEL_ON
NetU1_15: U2.30(PA6) ; port PCF8553_RESET
NetU1_16: U2.31(PA7) ; port PCF8553_SDIO
NetU1_19: U2.23(PA1) ; port PCF8553_SCL
NetU1_20: U2.28(PA4) ; port PCF8553_CE

Not connected (* = marked no-connect by the designer): U2 1(PE2) 2(PE3) 3(PE4) 4(PE5) 5(PE6) 29(PA5) 32(PB0) 34(PB2) 36(PE8) 37(PE9) 42(PE14) 52(PB13) 53(PB14) 54(PB15) 57(PD10) 58(PD11) 59(PD12) 62(PD15) 63(PC6) 64(PC7) 70(PA11) 71(PA12) 81(PD0) 86(PD5) 87(PD6)

### Notes on the sheet
- Puertos del uC  conectados a un port undefined, tienen funcion sugerida  pero no definida.
- Title:
- Size: A4
- Date:
- FMC-320U MODEL A
- Sheet:
- Time:
- Of:
- Version:
- Revision:
- Release:
- 1
- 0
- FLOWMEET SRL
- File

### Library data of the parts
U2 = STM32U575VIT6Q: Manufacturer: ST; Manufacturer Part Number: STM32U575VIT6Q; Category: Microcontrolador; Datasheet: https://www.st.com/resource/en/datasheet/stm32u575ag.pdf; Temperature Max: 85; Temperature Min: -40

## Sheet MCU_Power_Clock.SchDoc
size A4; Organization: Altium Limited; Address1: L3, 12a Rodborough Rd; Address2: Frenchs Forest; Address3: NSW; Address4: Australia 2086; SheetNumber: 7; SheetTotal: 7
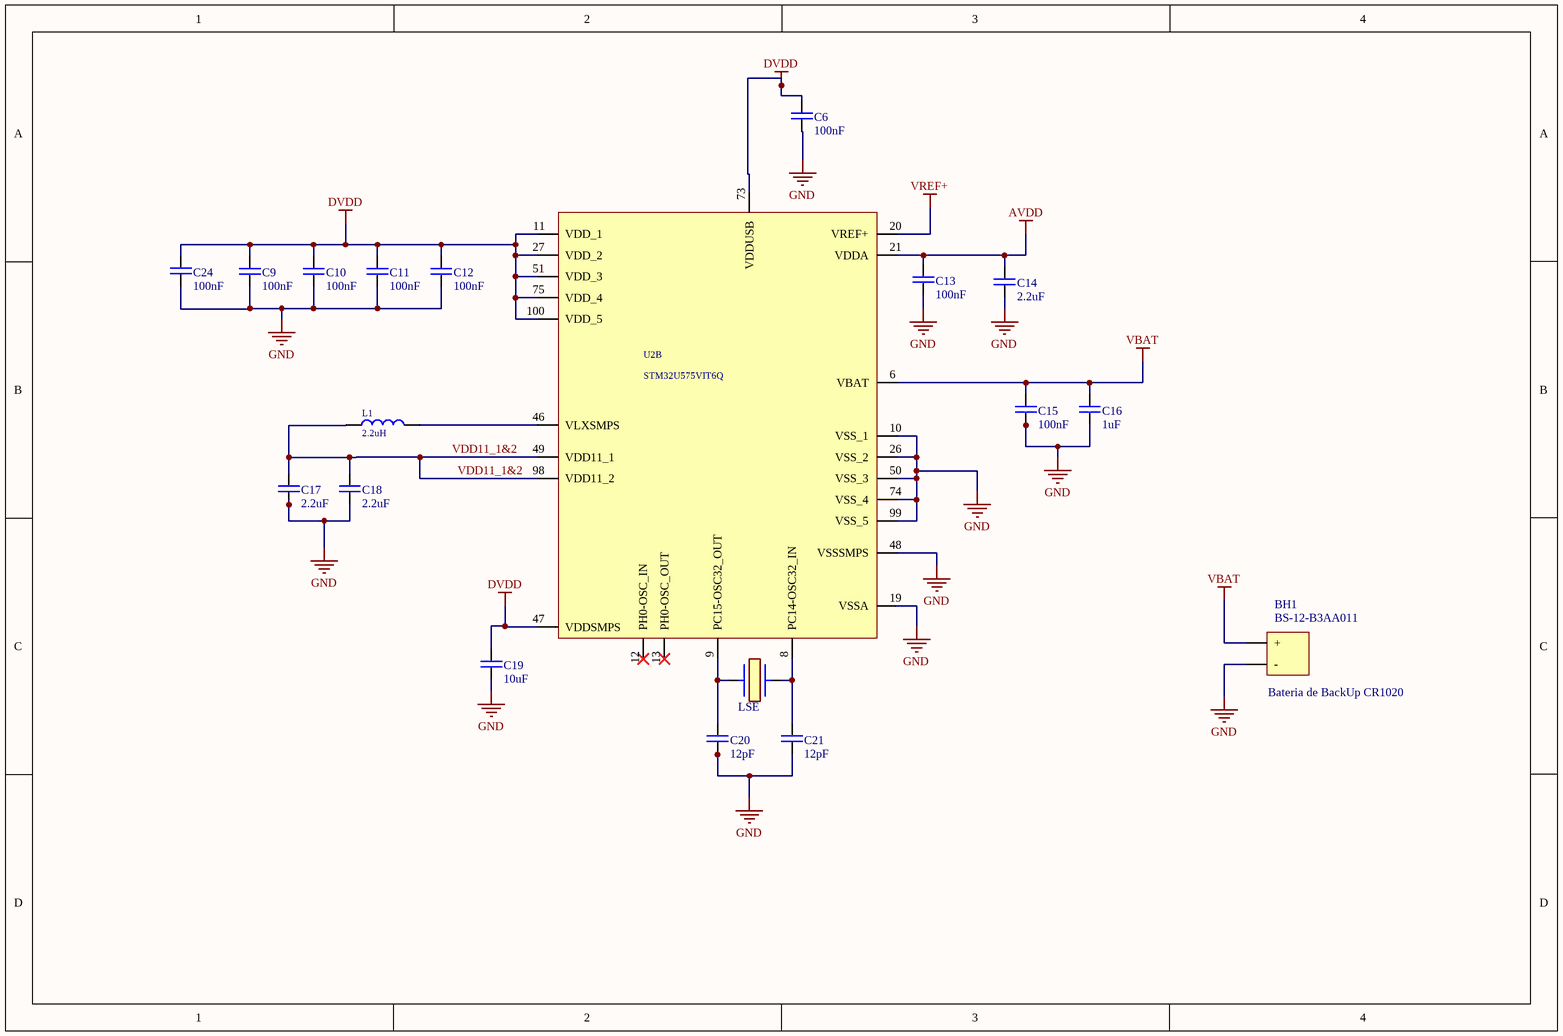
[diagram p6: MCU_Power_Clock.SchDoc]

### Parts
BH1  BS-12-B3AA011  [BS-12-B3AA011]
C6  100nF  [CAP_SM0603_YAGEOCC2_N]
C9  100nF  [CAP_SM0603_YAGEOCC2_N]
C10  100nF  [CAP_SM0603_YAGEOCC2_N]
C11  100nF  [CAP_SM0603_YAGEOCC2_N]
C12  100nF  [CAP_SM0603_YAGEOCC2_N]
C13  100nF  [CAP_SM0603_YAGEOCC2_N]
C14  2.2uF  [CAP_SM0603_YAGEOCC2_N]
C15  100nF  [CAP_SM0603_YAGEOCC2_N]
C16  1uF  [CAP_SM0603_YAGEOCC2_N]
C17  2.2uF  [CAP_SM0603_YAGEOCC2_N]
C18  2.2uF  [CAP_SM0603_YAGEOCC2_N]
C19  10uF  [CAP_SM0603_YAGEOCC2_N]
C20  12pF  [CAP_SM0603_YAGEOCC2_N]
C21  12pF  [CAP_SM0603_YAGEOCC2_N]
C24  100nF  [CAP_SM0603_YAGEOCC2_N]
L1  2.2uH  [LQM21PN2R2MGHL]
LSE  32,768 kHz  [SC-32S32.768kHz20PPM12.5pF]  (value not drawn)
U2  STM32U575VIT6Q  [STM32U575VI]  (part B of 3)

### Nets
AVDD: C13.1 C14.1 U2.21(VDDA)
DVDD: C6.1 C9.1 C10.1 C11.1 C12.1 C19.1 C24.1 U2.11(VDD_1) U2.27(VDD_2) U2.47(VDDSMPS) U2.51(VDD_3) U2.73(VDDUSB) U2.75(VDD_4) U2.100(VDD_5)
GND: BH1.NEG(-) C6.2 C9.2 C10.2 C11.2 C12.2 C13.2 C14.2 C15.2 C16.2 C17.2 C18.2 C19.2 C20.2 C21.2 C24.2 U2.10(VSS_1) U2.19(VSSA) U2.26(VSS_2) U2.48(VSSSMPS) U2.50(VSS_3) U2.74(VSS_4) U2.99(VSS_5)
VBAT: BH1.POS(+) C15.1 C16.1 U2.6(VBAT)
VREF+: U2.20(VREF+)
VDD11_1&2: C17.1 C18.1 L1.1 U2.49(VDD11_1) U2.98(VDD11_2)
NetC20_1: C20.1 LSE.1 U2.9(PC15-OSC32_OUT)
NetC21_1: C21.1 LSE.2 U2.8(PC14-OSC32_IN)
NetL1_2: L1.2 U2.46(VLXSMPS)

Not connected (* = marked no-connect by the designer): U2 12(PH0-OSC_IN)* 13(PH0-OSC_OUT)*

### Notes on the sheet
- (near BH1) Bateria de BackUp CR1020
- Title:
- Size: A4
- Date:
- FMC-320U MODEL A
- Sheet:
- Time:
- Of:
- Version:
- Revision:
- Release:
- 1
- 0
- FLOWMEET SRL
- File

### Library data of the parts
BH1 = BS-12-B3AA011: Battery holder CR1020 SMD; Manufacturer: Myoung; Manufacturer part number: BS-12-B3AA011; Category: Battery holder; Datasheet: https://datasheet.lcsc.com/lcsc/2012181809_MYOUNG-BS-08-B2AA016_C964792.pdf; Temperature Max: 85; Temperature Min: -25
C6 C9-C13 C15 C24 = CC0603KRX7R9BB104: as C5 on sheet Display_Indicators; Category: Capacitor; Manufacturer: Yageo; Manufacturer Part Number: CC0603KRX7R9BB104; Package: 0603; Value: 100nF; Supplier Part Number 1: 1362556; Supplier 1: Farnell; ComponentLink1URL: http://www.yageo.com; ComponentLink1Description: Manufacturer Website; Supplier 2: Digi-Key; Supplier Part Number 2: 311-1344-1-ND; Datasheet: https://datasheet.lcsc.com/lcsc/2211101700_YAGEO-CC0603KRX7R9BB104_C14663.pdf
C14 C17 C18 = CC0603KRX7R6BB225: CAP 2.2uF (2u2F) SM0603 X7R 10V YAGEO CC2; Tolerance (%): 10; Category: Capacitor; Manufacturer: Yageo; Manufacturer Part Number: CC0603KRX7R6BB225; Package: 0603; Value: 2.2uF; ComponentLink1URL: http://www.yageo.com; ComponentLink1Description: Manufacturer Website; Voltage Rating (Volts): 10; Datasheet: https://datasheet.lcsc.com/lcsc/2004231434_YAGEO-CC0603KRX7R6BB225_C513691.pdf
C16 = CC0603KRX7R6BB105: CAP 1uF SM0603 X7R 10V YAGEO CC2; Tolerance (%): 5; Voltage Rating (Volts): 50; Category: Capacitor; Manufacturer: Yageo; Manufacturer Part Number: CC0603KRX7R6BB105; Package: 0603; Value: 1uF; ComponentLink1URL: http://www.yageo.com; ComponentLink1Description: Manufacturer Website; Datasheet: https://datasheet.lcsc.com/lcsc/2304140030_YAGEO-CC0603KRX7R6BB105_C113807.pdf
C19 = CC0603KRX5R6BB106: as C23 on sheet Interboard; Category: Capacitor; Manufacturer: Yageo; Manufacturer Part Number: CC0603KRX5R6BB106; Package: 0603; Value: 10uF; ComponentLink1Description: Manufacturer Website; ComponentLink1URL: http://www.yageo.com
C20 C21 = CC0603JRNPO9BN120: CAP 12pF SM0603 NPO 50V YAGEO CC2; Tolerance (%): 5; Voltage Rating (Volts): 50; Category: Capacitor; Manufacturer: Yageo; Manufacturer Part Number: CC0603JRNPO9BN120; Package: 0603; Value: 12pF; Supplier Part Number 1: 721979; Supplier 1: Farnell; ComponentLink1URL: http://www.yageo.com; ComponentLink1Description: Manufacturer Website; Supplier 2: Digi-Key; Supplier Part Number 2: 311-1059-1-ND; Datasheet: https://datasheet.lcsc.com/lcsc/2304140030_YAGEO-CC0603JRNPO9BN120_C107034.pdf
L1 = LQM21PN2R2MGHL: Inductores de potencia - SMD 2.2 UH 20%; Manufacturer: Murata Electronics; Manufacturer Part Number: LQM21PN2R2MGHL; Category: Inductor; Value: 2.2uH; Datasheet: https://ar.mouser.com/datasheet/2/281/1/JELF243B_0040-961444.pdf; Temperature Max: 85; Temperature Min: -40
LSE = SC32S-12.5PF20PPM: Cristal Oscilador 32.768 kHz, 12.5pF; Manufacturer: Seiko; Manufacturer Part Number: SC32S-12.5PF20PPM; Category: Cristal Oscilador; Value: 32,768 kHz; Datasheet: https://datasheet.lcsc.com/lcsc/1811151435_Seiko-SC-32S32-768kHz20PPM12-5pF_C97606.pdf; Temperature Max: 85; Temperature Min: -40
U2 = STM32U575VIT6Q: Manufacturer: ST; Manufacturer Part Number: STM32U575VIT6Q; Category: Microcontrolador; Datasheet: https://www.st.com/resource/en/datasheet/stm32u575ag.pdf; Temperature Max: 85; Temperature Min: -40

## Nets that join several sheets
AVDD: Interboard (CN3.1), MCU_Power_Clock (C13.1 C14.1 U2.21)
DVDD: Display_Indicators (7 pins), Interboard (C23.1 CN2.1 CN2.17), Keypad_Temp_BatLevel (13 pins), MCU_Power_Clock (14 pins)
GND: Display_Indicators (6 pins), Interboard (9 pins), Keypad_Temp_BatLevel (12 pins), MCU_Debug (7 pins), MCU_Power_Clock (23 pins)
VDD: Interboard (C8.1 CN2.3), MCU_Debug (CN4.3)
VREF+: Interboard (CN3.3), MCU_Power_Clock (U2.20)
FLOW_CMP_OUT: Interboard (CN2.15), MCU_GPIO (U2.7 U2.33 U2.60 U2.61)
FLOW_DETECTOR: Interboard (CN3.10), MCU_GPIO (U2.43)
FLUID_TEMP_AN: Interboard (CN3.8), MCU_GPIO (U2.15)
I2C1_SCL: Keypad_Temp_BatLevel (R5.1 U3.2), MCU_GPIO (U2.95)
I2C1_SDA: Keypad_Temp_BatLevel (R4.1 U3.1), MCU_GPIO (U2.96)
KEY_DOWN: Keypad_Temp_BatLevel (C3.2 CN1.5 R22.2), MCU_GPIO (U2.38)
KEY_ENTER: Keypad_Temp_BatLevel (C4.1 CN1.3 R24.2), MCU_GPIO (U2.40)
KEY_ESC: Keypad_Temp_BatLevel (C7.1 CN1.2 R23.2), MCU_GPIO (U2.41)
KEY_UP: Keypad_Temp_BatLevel (C2.1 CN1.4 R8.2), MCU_GPIO (U2.39)
LCD_BACKLIGHT: Display_Indicators (Q1.G R9.1), MCU_GPIO (U2.97)
LED_ACTIVE: Display_Indicators (R2.1), MCU_GPIO (U2.92)
LED_ERROR: Display_Indicators (R1.1), MCU_GPIO (U2.91)
LED_SIGNAL: Display_Indicators (R3.1), MCU_GPIO (U2.93)
NetR6_1: Keypad_Temp_BatLevel (R6.1 R7.2), MCU_GPIO (U2.16)
NetR6_2: Keypad_Temp_BatLevel (R6.2), MCU_GPIO (U2.35)
NetU1_15: Display_Indicators (U1.15), MCU_GPIO (U2.30)
NetU1_16: Display_Indicators (U1.16), MCU_GPIO (U2.31)
NetU1_19: Display_Indicators (U1.19), MCU_GPIO (U2.23)
NetU1_20: Display_Indicators (U1.20), MCU_GPIO (U2.28)
PA0_RSVD: Interboard (CN2.10), MCU_GPIO (U2.22)
PA2_USART2_RSVD: Interboard (CN2.8), MCU_GPIO (U2.24)
PA3_USART2_RSVD: Interboard (CN2.6), MCU_GPIO (U2.25)
PB10-RSVD: Interboard (CN3.5), MCU_GPIO (U2.44)
PB11-RSVD: Interboard (CN3.9), MCU_GPIO (U2.45)
PC2_AN_RSVD: Interboard (CN3.6), MCU_GPIO (U2.17)
PC3_AN_RSVD: Interboard (CN3.4), MCU_GPIO (U2.18)
PC9_RSRVD: Interboard (CN2.18), MCU_GPIO (U2.66)
PC10_SPI3_RSVD: Interboard (CN2.13), MCU_GPIO (U2.78)
PC11_SPI3_RSVD: Interboard (CN2.11), MCU_GPIO (U2.79)
PC12_SPI3_RSVD: Interboard (CN2.9), MCU_GPIO (U2.80)
PD1: Interboard (R26.2), MCU_GPIO (U2.82)
PD2: Interboard (R25.2), MCU_GPIO (U2.83)
PD3: Interboard (R21.2), MCU_GPIO (U2.84)
PD4: Interboard (R20.2), MCU_GPIO (U2.85)
PD7_RSVD: Interboard (CN2.7), MCU_GPIO (U2.88)
RADIO_ENABLE: Interboard (CN2.16), MCU_GPIO (U2.67)
RADIO_PWR_ON: Interboard (CN2.20), MCU_GPIO (U2.65)
RADIO_UART_RX: Interboard (CN2.12), MCU_GPIO (U2.55)
RADIO_UART_TX: Interboard (CN2.14), MCU_GPIO (U2.56)
USART1_RX: MCU_Debug (ESD2.1 R19.2), MCU_GPIO (U2.69)
USART1_TX: MCU_Debug (ESD2.5 R13.2), MCU_GPIO (U2.68)